# Altium schematic sheet USBtoUART.SchDoc
size A
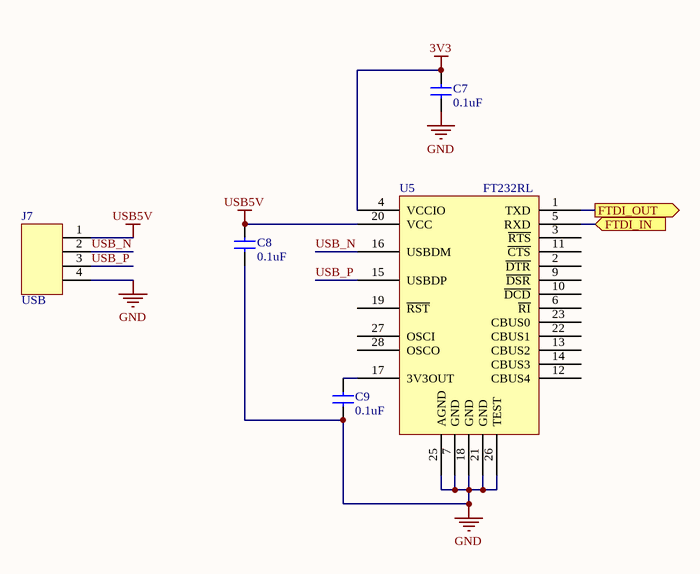
[diagram p0: USBtoUART.SchDoc]

## Parts
C7  value 0.1uF  [CAPC0603]  (hidden comment: Cap)
C8  value 0.1uF  [CAPC0603]  (hidden comment: Cap)
C9  value 0.1uF  [CAPC0603]  (hidden comment: Cap)
J7  USB  [MOLEX-HDR-1X4-SHERLOCK-VERT]
U5  FT232RL  [SSOP_28_N]

## Ports
FTDI_IN (in), FTDI_OUT (out)

## Nets
3V3: C7.1(A) U5.4(VCCIO)
GND: C7.2(B) C8.2(B) C9.2(B) J7.4 U5.7(GND) U5.18(GND) U5.21(GND) U5.25(AGND) U5.26(TEST)
USB5V: C8.1(A) J7.1 U5.20(VCC)
FTDI_IN: U5.5(RXD) ; port FTDI_IN
FTDI_OUT: U5.1(TXD) ; port FTDI_OUT
USB_N: J7.2 U5.16(USBDM)
USB_P: J7.3 U5.15(USBDP)
NetC9_1: C9.1(A) U5.17(3V3OUT)

Not connected (* = marked no-connect by the designer): U5 2(~{DTR}) 3(~{RTS}) 6(~{RI}) 9(~{DSR}) 10(~{DCD}) 11(~{CTS}) 12(CBUS4) 13(CBUS2) 14(CBUS3) 19(~{RST}) 22(CBUS1) 23(CBUS0) 27(OSCI) 28(OSCO)

## Library data of the parts
J7 = MOLEX-HDR-1x4-SHERLOCK_VERT: Header, Molex, 2mm Pitch Sherlock Header, Single Row, Vertical, 4 Circuits, Length 3.3mm, 0353620450; Manufacturer Part Number: *; Order Part Number: *
U5 = FT232RL: IC USB FS SERIAL UART 28-SSOP; Supplier Part Number 1: 768-1007-1-ND; Supplier 1: Digi-Key
C7-C9 = Cap: Supplier 1: Digi-Key; Supplier Part Number 1: 1276-1000-1-ND